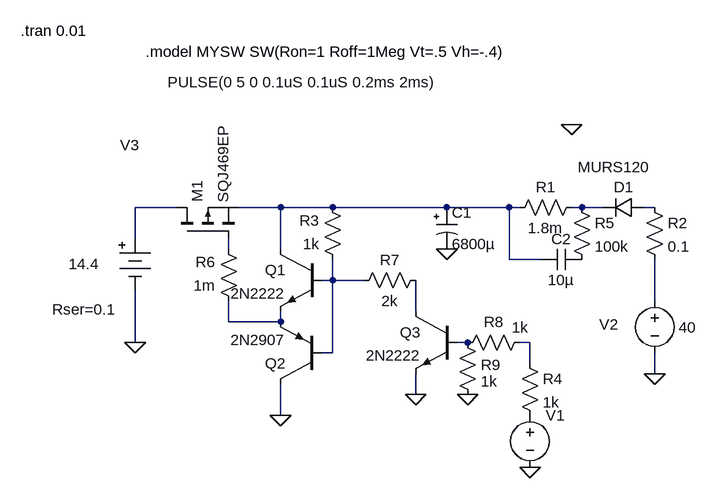
[diagram p0: schematic prostownik P1.asc]
prostownik P1.asc, the LTspice schematic file:
Version 4
SHEET 1 1276 680
WIRE -352 96 -416 96
WIRE -192 96 -256 96
WIRE -112 96 -192 96
WIRE 64 96 -112 96
WIRE 160 96 64 96
WIRE 176 96 160 96
WIRE 272 96 256 96
WIRE 304 96 272 96
WIRE 384 96 368 96
WIRE -416 144 -416 96
WIRE -272 160 -272 144
WIRE -192 160 -192 96
WIRE 160 176 160 96
WIRE 208 176 160 176
WIRE -112 208 -112 176
WIRE -112 208 -128 208
WIRE -64 208 -112 208
WIRE 384 240 384 176
WIRE 16 256 16 208
WIRE -272 272 -272 240
WIRE -192 272 -192 256
WIRE -192 272 -272 272
WIRE -416 304 -416 224
WIRE 96 304 80 304
WIRE 192 304 176 304
WIRE -112 320 -112 208
WIRE -112 320 -128 320
WIRE 192 336 192 304
WIRE 384 352 384 320
WIRE 16 384 16 352
WIRE -192 416 -192 368
FLAG -416 304 0
FLAG -192 416 0
FLAG 192 496 0
FLAG 64 160 0
FLAG 384 352 0
FLAG 256 -32 0
FLAG 16 384 0
FLAG 96 384 0
SYMBOL voltage 192 400 R0
WINDOW 3 -558 -497 Left 2
WINDOW 123 0 0 Left 2
WINDOW 39 24 44 Left 2
SYMATTR Value PULSE(0 5 0 0.1uS 0.1uS 0.2ms 2ms)
SYMATTR InstName V1
SYMBOL voltage 384 224 R0
WINDOW 0 -85 52 Left 2
WINDOW 3 37 57 Left 2
WINDOW 123 0 0 Left 2
WINDOW 39 37 85 Left 2
SYMATTR InstName V2
SYMATTR Value 40
SYMBOL res 272 80 R90
WINDOW 0 0 56 VBottom 2
WINDOW 3 32 56 VTop 2
SYMATTR InstName R1
SYMATTR Value 1.8m
SYMBOL Misc\\battery -416 128 R0
WINDOW 0 -23 -128 Left 2
WINDOW 3 -102 55 Left 2
WINDOW 123 0 0 Left 2
WINDOW 39 -128 125 Left 2
SYMATTR InstName V3
SYMATTR Value 14.4
SYMATTR SpiceLine Rser=0.1
SYMBOL diode 368 80 R90
WINDOW 0 0 32 VBottom 2
WINDOW 3 -62 47 VTop 2
SYMATTR InstName D1
SYMATTR Value MURS120
SYMBOL polcap 48 96 R0
WINDOW 3 24 56 Left 2
SYMATTR Value 6800µ
SYMATTR InstName C1
SYMATTR Description Capacitor
SYMATTR Type cap
SYMATTR SpiceLine V=25 Irms=2.07 Rser=0.03 Lser=0 mfg="Nichicon" pn="UPR1E682MRH" type="Al electrolytic"
SYMBOL res 368 80 R0
SYMATTR InstName R2
SYMATTR Value 0.1
SYMBOL pmos -352 144 R270
SYMATTR InstName M1
SYMATTR Value SQJ469EP
SYMBOL res 176 320 R0
SYMATTR InstName R4
SYMATTR Value 1k
SYMBOL res 256 80 R0
SYMATTR InstName R5
SYMATTR Value 100k
SYMBOL cap 272 160 R90
WINDOW 0 0 32 VBottom 2
WINDOW 3 32 32 VTop 2
SYMATTR InstName C2
SYMATTR Value 10µ
SYMBOL npn -128 160 M0
SYMATTR InstName Q1
SYMATTR Value 2N2222
SYMBOL res -96 192 R180
WINDOW 0 36 76 Left 2
WINDOW 3 36 40 Left 2
SYMATTR InstName R3
SYMATTR Value 1k
SYMBOL pnp -128 368 R180
SYMATTR InstName Q2
SYMATTR Value 2N2907
SYMBOL res -256 256 R180
WINDOW 0 36 76 Left 2
WINDOW 3 36 40 Left 2
SYMATTR InstName R6
SYMATTR Value 1m
SYMBOL res 32 192 R90
WINDOW 0 0 56 VBottom 2
WINDOW 3 32 56 VTop 2
SYMATTR InstName R7
SYMATTR Value 2k
SYMBOL npn 80 256 M0
SYMATTR InstName Q3
SYMATTR Value 2N2222
SYMBOL res 192 288 R90
WINDOW 0 0 56 VBottom 2
WINDOW 3 -23 15 VTop 2
SYMATTR InstName R8
SYMATTR Value 1k
SYMBOL res 80 288 R0
WINDOW 0 36 50 Left 2
SYMATTR InstName R9
SYMATTR Value 1k
TEXT -400 -144 Left 2 !.model MYSW SW(Ron=1 Roff=1Meg Vt=.5 Vh=-.4)
TEXT -592 -176 Left 2 !.tran 0.01

The netlist it stands for:
* prostownik P1.asc
V1 P001 0 PULSE(0 5 0 0.1uS 0.1uS 0.2ms 2ms)
V2 N007 0 40
R1 N003 N002 1.8m
V3 N001 0 14.4 Rser=0.1
D1 N004 N003 MURS120
C1 N002 0 6800µ V=25 Irms=2.07 Rser=0.03 Lser=0 mfg="Nichicon" pn="UPR1E682MRH" type="Al electrolytic"
R2 N004 N007 0.1
M1 N001 N005 N002 N002 SQJ469EP
R4 N011 P001 1k
R5 N003 P002 100k
C2 P002 N002 10µ
Q1 N002 N006 N009 0 2N2222
R3 N006 N002 1k
Q2 0 N006 N009 0 2N2907
R6 N009 N005 1m
R7 N008 N006 2k
Q3 N008 N010 0 0 2N2222
R8 N011 N010 1k
R9 N010 0 1k
.model D D
.lib standard.dio
.model NPN NPN
.model PNP PNP
.lib standard.bjt
.model NMOS NMOS
.model PMOS PMOS
.lib standard.mos
.model MYSW SW(Ron=1 Roff=1Meg Vt=.5 Vh=-.4)
.tran 0.01
.backanno
.end